# EAGLE schematic USB To Uart_5V_3V3 v1 (EAGLE 6.1)
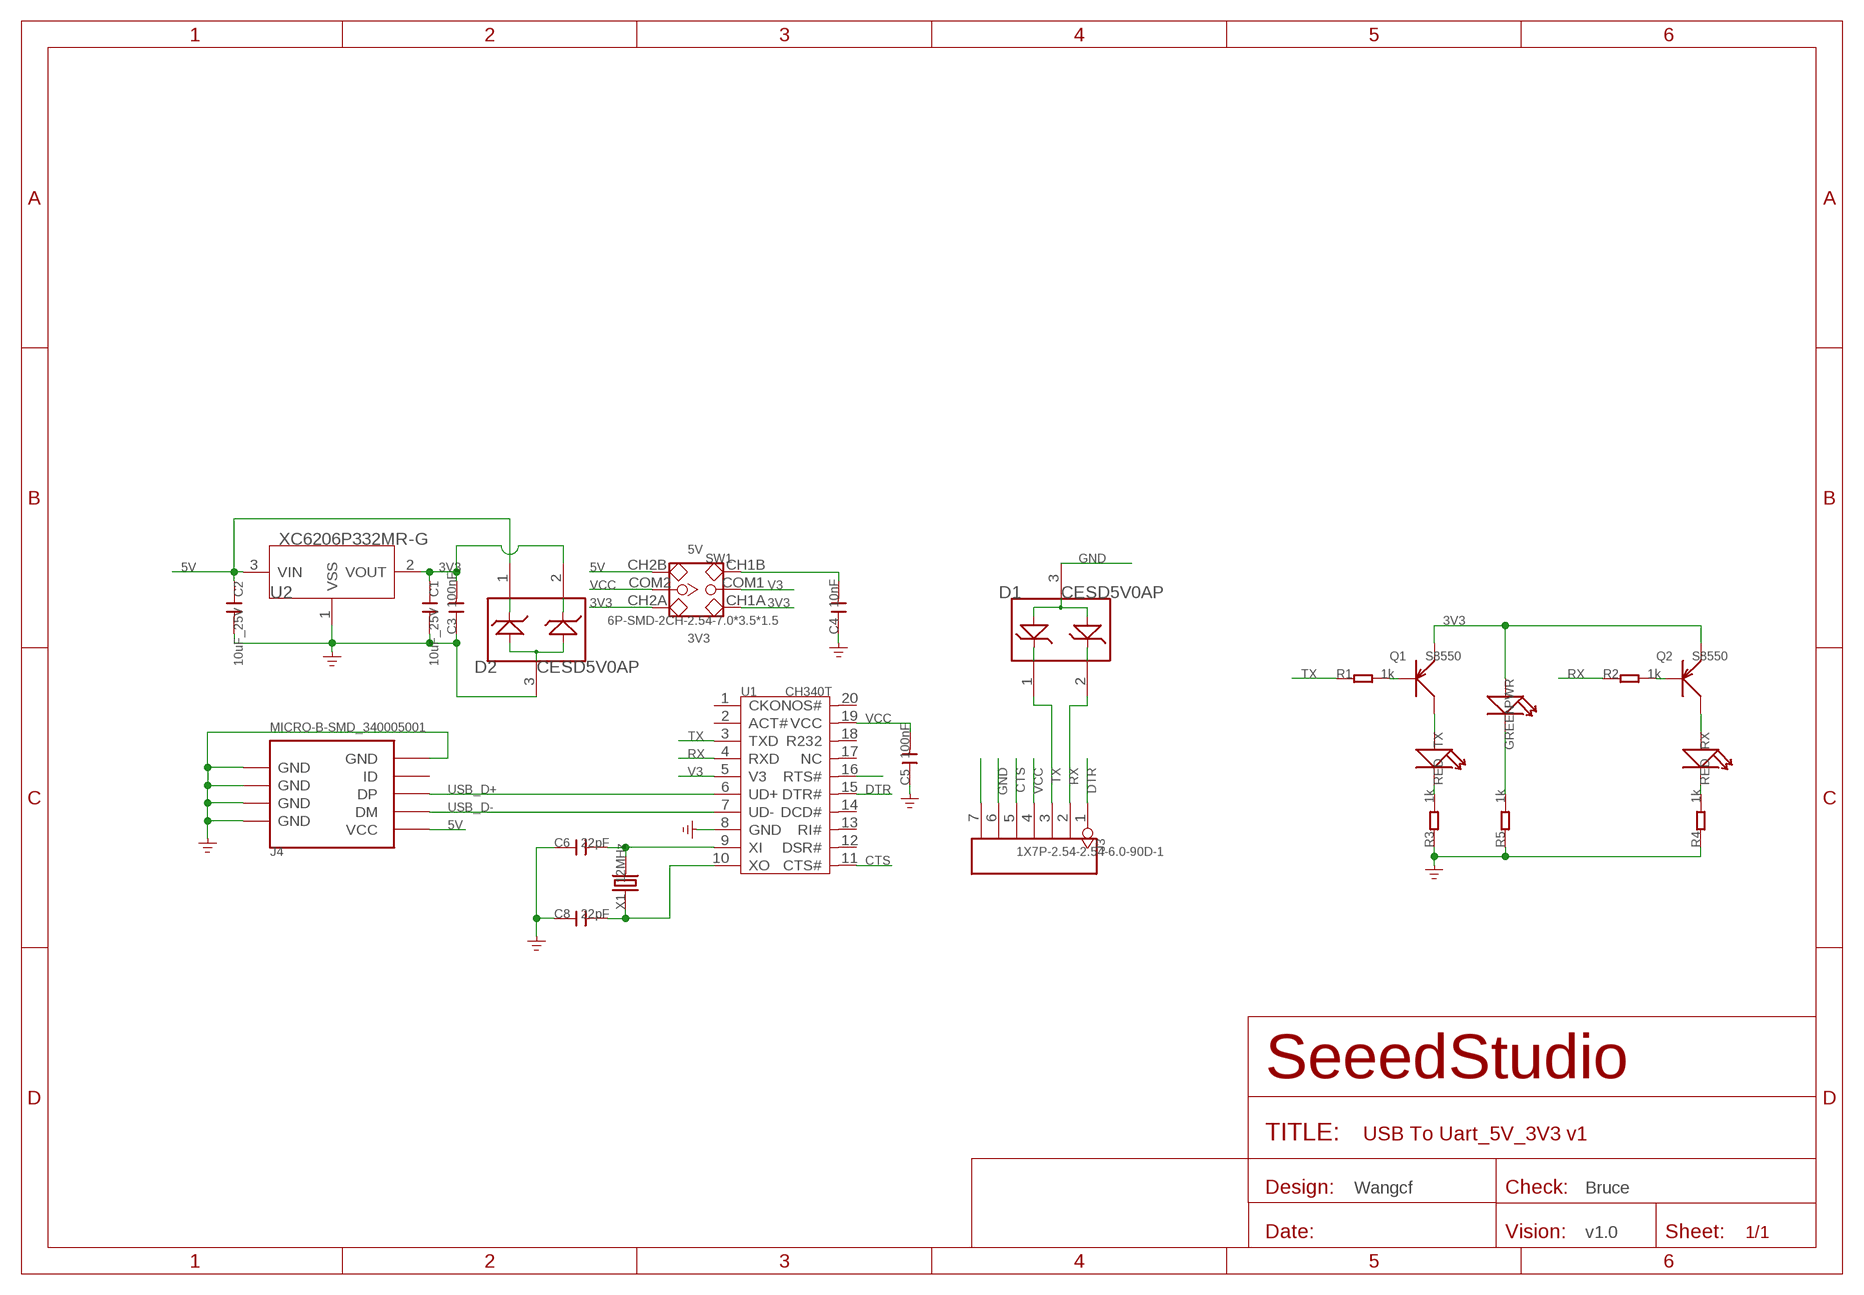
[diagram p0: schematic, sheet 1]

## Parts
C1  10uF_25V  C-0805  [C0805]
C2  10uF_25V  C-0805  [C0805]
C3  100nF  C-0402  [C0402]
C4  10nF  C-0402  [C0402]
C5  100nF  C-0402  [C0402]
C6  22pF  C-0402  [C0402]
C8  22pF  C-0402  [C0402]
D1  CESD5V0AP  D-ESD-3P  [SOT23]
D2  CESD5V0AP  D-ESD-3P  [SOT23]
J3  1X7P-2.54-2.54-6.0-90D-1  HEADER-7P  [7P-2.54-65/35MIL]
J4  MICRO-B-SMD_340005001  USB-MINIUSB-5P-MICRO  [MICRO-USB]
PWR  GREEN  LED'0603'  [LED-0603]
Q1  S8550  TRANSISTOR-PNP-SOT23  [SOT23]
Q2  S8550  TRANSISTOR-PNP-SOT23  [SOT23]
R1  1k  R-0402  [R0402]
R2  1k  R-0402  [R0402]
R3  1k  R-0402  [R0402]
R4  1k  R-0402  [R0402]
R5  1k  R-0402  [R0402]
RX  RED  LED'0603'  [LED-0603]
SW1  6P-SMD-2CH-2.54-7.0*3.5*1.5  SWITCH-2CH-6P-SMD  [6P-SMD-2CH-2.54-3.5X7.2]
TX  RED  LED'0603'  [LED-0603]
U1  CH340T  [SSOP20]
U2  XC6206P332MR-G  XC6206MR  [SOT23]
X1  12MHz  CRYSTAL'5032'  [2P-SMD-5X3.2]

## Nets
3V3: C1.1 C3.2 D2.2 PWR.+ Q1.2(E) Q2.2(E) SW1.CH1A SW1.CH2A U2.2(VOUT)
5V: C2.1 D2.1 J4.1(VCC) SW1.CH2B U2.3(VIN)
CTS: J3.5 U1.11(CTS#)
DTR: J3.1 U1.15(DTR#)
GND: C1.2 C2.2 C3.1 C4.1 C5.1 C6.1 C8.1 D1.3 D2.3 J3.6 J4.5(GND) J4.S1(GND) J4.S2(GND) J4.S3(GND) J4.S4(GND) J4.S5(GND) J4.S6(GND) R3.1 R4.1 R5.1 U1.8(GND) U2.1(VSS)
N$1: Q1.3(C) TX.+
N$2: Q2.3(C) RX.+
N$3: J3.7 U1.16(RTS#)
N$4: C6.2 U1.9(XI) X1.2
N$5: C8.2 U1.10(XO) X1.1
N$6: R3.2 TX.-
N$7: Q1.1(B) R1.2
N$8: Q2.1(B) R2.2
N$9: C4.2 SW1.CH1B
N$10: R4.2 RX.-
N$12: PWR.- R5.2
RX: D1.2 J3.2 R2.1 U1.4(RXD)
TX: D1.1 J3.3 R1.1 U1.3(TXD)
USB_D+: J4.3(DP) U1.6(UD+)
USB_D-: J4.2(DM) U1.7(UD-)
V3: SW1.COM1 U1.5(V3)
VCC: C5.2 J3.4 SW1.COM2 U1.19(VCC)
Unconnected: J4.4(ID) U1.1(CKO) U1.2(ACT#) U1.12(DSR#) U1.13(RI#) U1.14(DCD#) U1.17(NC) U1.18(R232) U1.20(NOS#)

## Notes on the sheet
- 5V
- 3V3
- Wangcf | Bruce
- v1.0

## Library data of the parts
C1-C6 C8 = Discrete:C*: Ceramic Capacitors
D1 D2 = Discrete:D-ESD-3P
J3 = Connector :HEADER-7P
J4 = Connector :USB-MINIUSB-5P
PWR RX TX = Discrete:LED*
Q1 Q2 = Discrete:TRANSISTOR-PNP*: PNP audion
R1-R5 = Discrete:R*
SW1 = Discrete:SWITCH-2CH-6P
U1 = template:CH340T
U2 = IC:XC6206: LOW ESR Cap.Compatible Positive Voltage Regulators
X1 = Discrete:CRYSTAL*: CRYSTAL

## Net classes
0 default: width 0.152 mm, drill 0.305 mm, clearance 0.152 mm